# EAGLE design VOC&eCO2_Gas_Sensor (EAGLE 6.4)

## Sheet 1 of 2
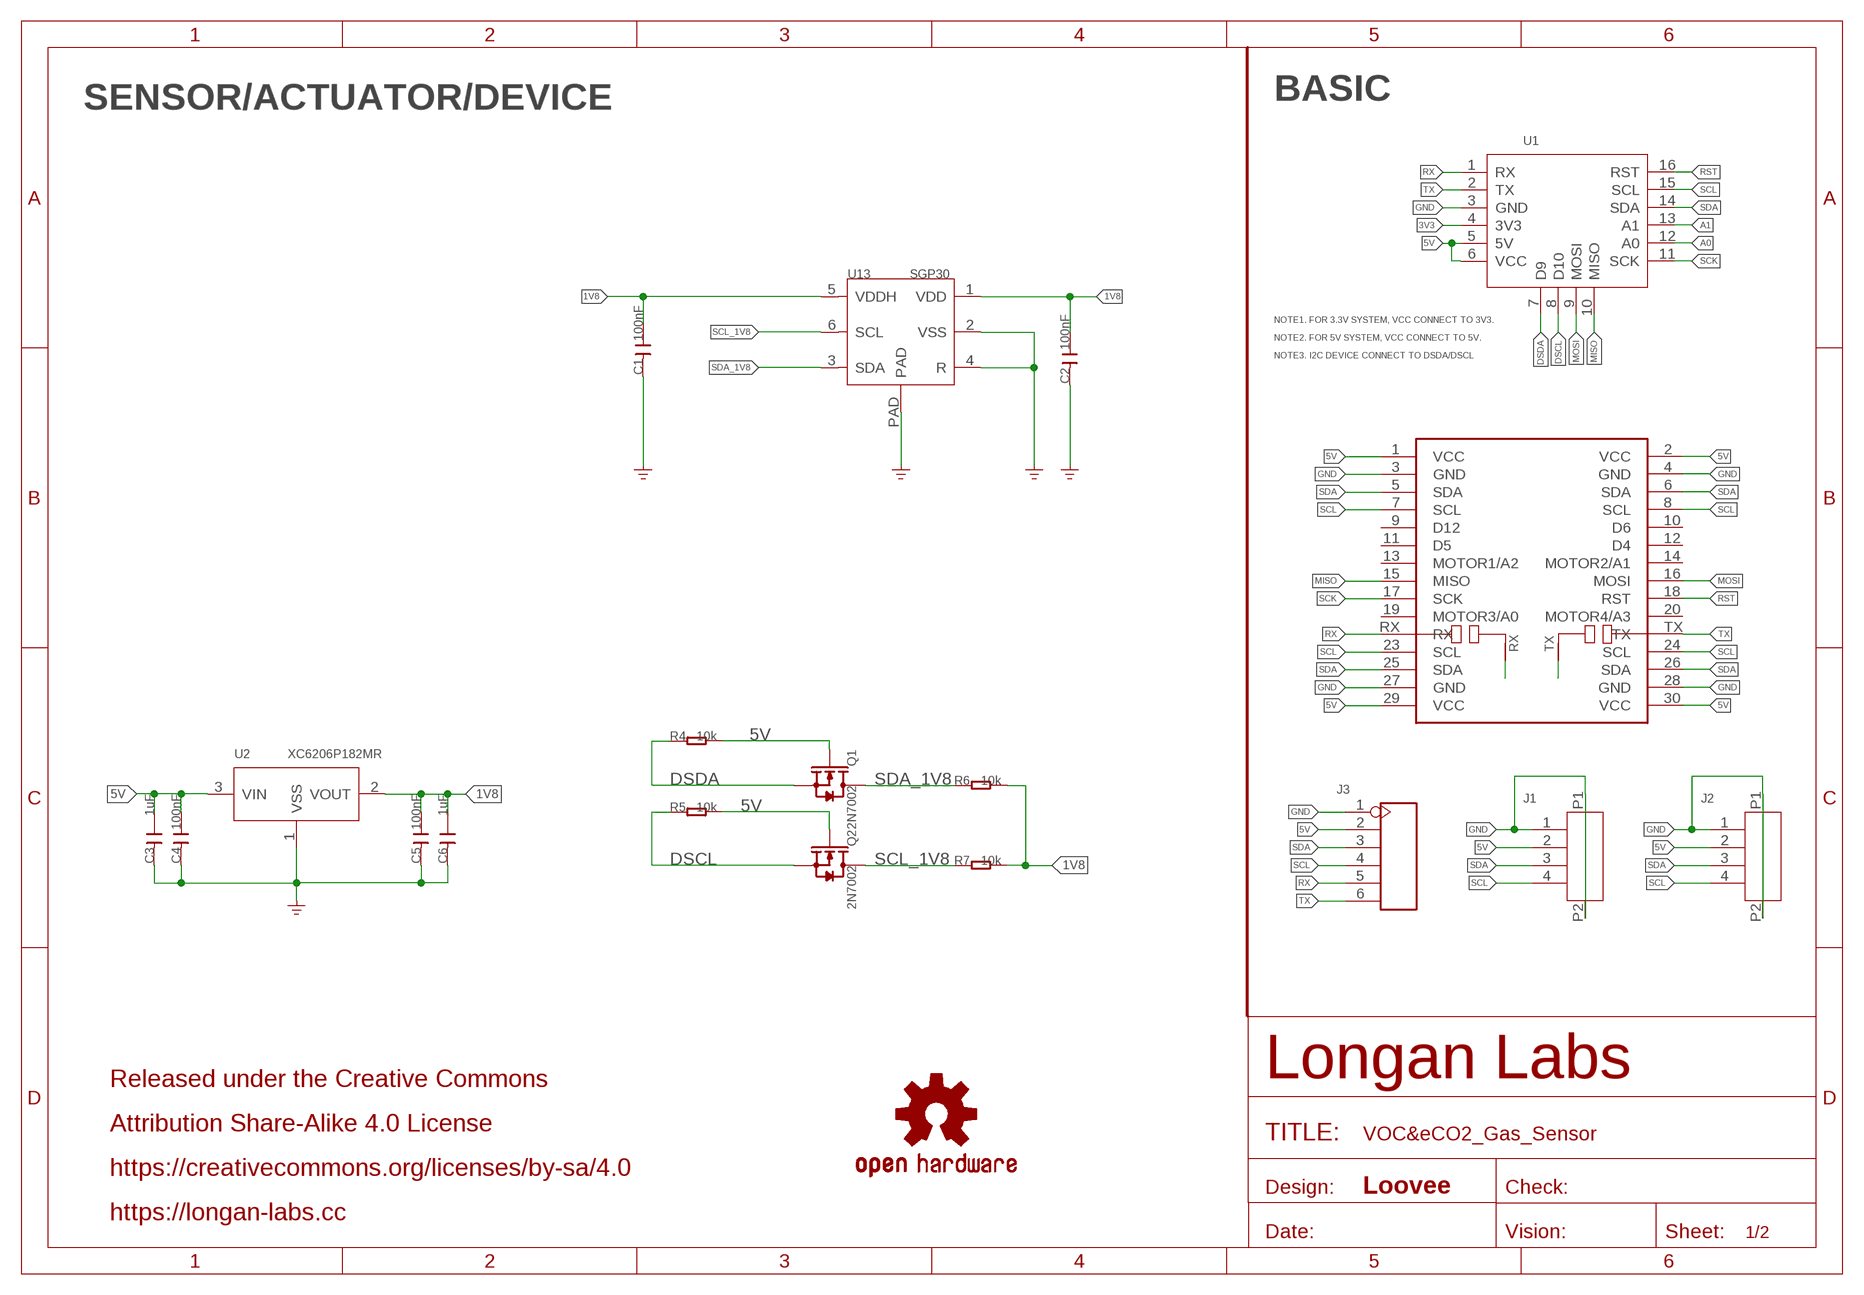
[diagram p0: schematic, sheet 1]

### Parts
C1  100nF  CAP-0603  [C0603]
C2  100nF  CAP-0603  [C0603]
C3  1uF  CAP-0603  [C0603]
C4  100nF  CAP-0603  [C0603]
C5  100nF  CAP-0603  [C0603]
C6  1uF  CAP-0603  [C0603]
J1  HEADER-4P-1.0  [4P-1.0-90D]
J2  HEADER-4P-1.0  [4P-1.0-90D]
J3  HEADER-6P-55/35MIL  [H6-2.54]
LOGO2  OSHW-LOGOS  [OSHW-LOGO-S]
MOUDLE2  MOUDLE-CARDS-UART'BOARD'  [MOUDLE-2X15P-UART]
Q1  2N7002  MOSFET-N'SOT23'  [SOT23]
Q2  2N7002  MOSFET-N'SOT23'  [SOT23]
R4  10k  R-0603  [R0603]
R5  10k  R-0603  [R0603]
R6  10k  R-0603  [R0603]
R7  10k  R-0603  [R0603]
U1  MOUDLE-CARDS  [16P-2.0-CARDS]
U2  XC6206P182MR  PMIC-XC6206PMR  [SOT-23]
U13  SGP30  SENSOR-GAS-SGP30  [DFN6-0.8-2.45X2.45X0.9MM]

### Nets
1V8: C1.1 C2.1 C5.1 C6.1 R6.2 R7.2 U2.2(VOUT) U13.1(VDD) U13.5(VDDH)
3V3: U1.4(3V3)
5V: C3.1 C4.1 J1.2 J2.2 J3.2 MOUDLE2.1(VCC) MOUDLE2.2(VCC) MOUDLE2.29(VCC) MOUDLE2.30(VCC) Q1.1(G) Q2.1(G) R4.2 R5.2 U1.5(5V) U1.6(VCC) U2.3(VIN)
A0: U1.12(A0)
A1: U1.13(A1)
DSCL: Q2.2(S) R5.1 U1.8(D10)
DSDA: Q1.2(S) R4.1 U1.7(D9)
GND: C1.2 C2.2 C3.2 C4.2 C5.2 C6.2 J1.1 J1.P1 J1.P2 J2.1 J2.P1 J2.P2 J3.1 MOUDLE2.3(GND) MOUDLE2.4(GND) MOUDLE2.27(GND) MOUDLE2.28(GND) U1.3(GND) U2.1(VSS) U13.2(VSS) U13.4(R) U13.PAD ; supply symbol labelled GND_POWER
MISO: MOUDLE2.15(MISO) U1.10(MISO)
MOSI: MOUDLE2.16(MOSI) U1.9(MOSI)
N$1: MOUDLE2.RX/N1(RX/N) MOUDLE2.RX/N2(RX/N)
N$2: MOUDLE2.TX/N1(TX/N) MOUDLE2.TX/N2(TX/N)
RST: MOUDLE2.18(RST) U1.16(RST)
RX: J3.5 MOUDLE2.RX U1.1(RX)
SCK: MOUDLE2.17(SCK) U1.11(SCK)
SCL: J1.4 J2.4 J3.4 MOUDLE2.7(SCL) MOUDLE2.8(SCL) MOUDLE2.23(SCL) MOUDLE2.24(SCL) U1.15(SCL)
SCL_1V8: Q2.3(D) R7.1 U13.6(SCL)
SDA: J1.3 J2.3 J3.3 MOUDLE2.5(SDA) MOUDLE2.6(SDA) MOUDLE2.25(SDA) MOUDLE2.26(SDA) U1.14(SDA)
SDA_1V8: Q1.3(D) R6.1 U13.3(SDA)
TX: J3.6 MOUDLE2.TX U1.2(TX)
Unconnected: MOUDLE2.9(D12) MOUDLE2.10(D6) MOUDLE2.11(D5) MOUDLE2.12(D4) MOUDLE2.13(MOTOR1/A2) MOUDLE2.14(MOTOR2/A1) MOUDLE2.19(MOTOR3/A0) MOUDLE2.20(MOTOR4/A3)

### Notes on the sheet
- SENSOR/ACTUATOR/DEVICE | BASIC
- NOTE1. FOR 3.3V SYSTEM, VCC CONNECT TO 3V3.
- NOTE2. FOR 5V SYSTEM, VCC CONNECT TO 5V.
- NOTE3. I2C DEVICE CONNECT TO DSDA/DSCL
- Released under the Creative Commons
- Attribution Share-Alike 4.0 License
- https://creativecommons.org/licenses/by-sa/4.0
- Loovee
- https://longan-labs.cc

## Sheet 2 of 2

## Library data of the parts
C1-C6 = Discrete-new:CAP: Ceramic Capacitors
J1 J2 = Longan-Connect:HEADER-4P-1.0
J3 = Connector-new:HEADER-6P
LOGO2 = SparkFun-Aesthetics:OSHW-LOGO: Open-Source Hardware (OSHW) Logo This logo indicates the piece of hardware it is found on incorporates a OSHW license and/or adheres to the definition of open source hardware found here: http://freedomdefined.org/OSHW
MOUDLE2 = Longan-moudle:MOUDLE-CARDS-UART
Q1 Q2 = Discrete:MOSFET-N: IRLL014: http://www.vishay.com/docs/91319/sihll014.pdf
R4-R7 = Discrete:R*
U1 = MOUDLE-CARDS:MOUDLE-CARDS
U2 = IC-new:PMIC-XC6206P: LOW ESR Cap.Compatible Positive Voltage Regulators
U13 = Discrete-new:SENSOR-GAS-SGP30

## Net classes
0 default: width 0.203 mm, drill 0.254 mm, clearance 0.152 mm

## Board
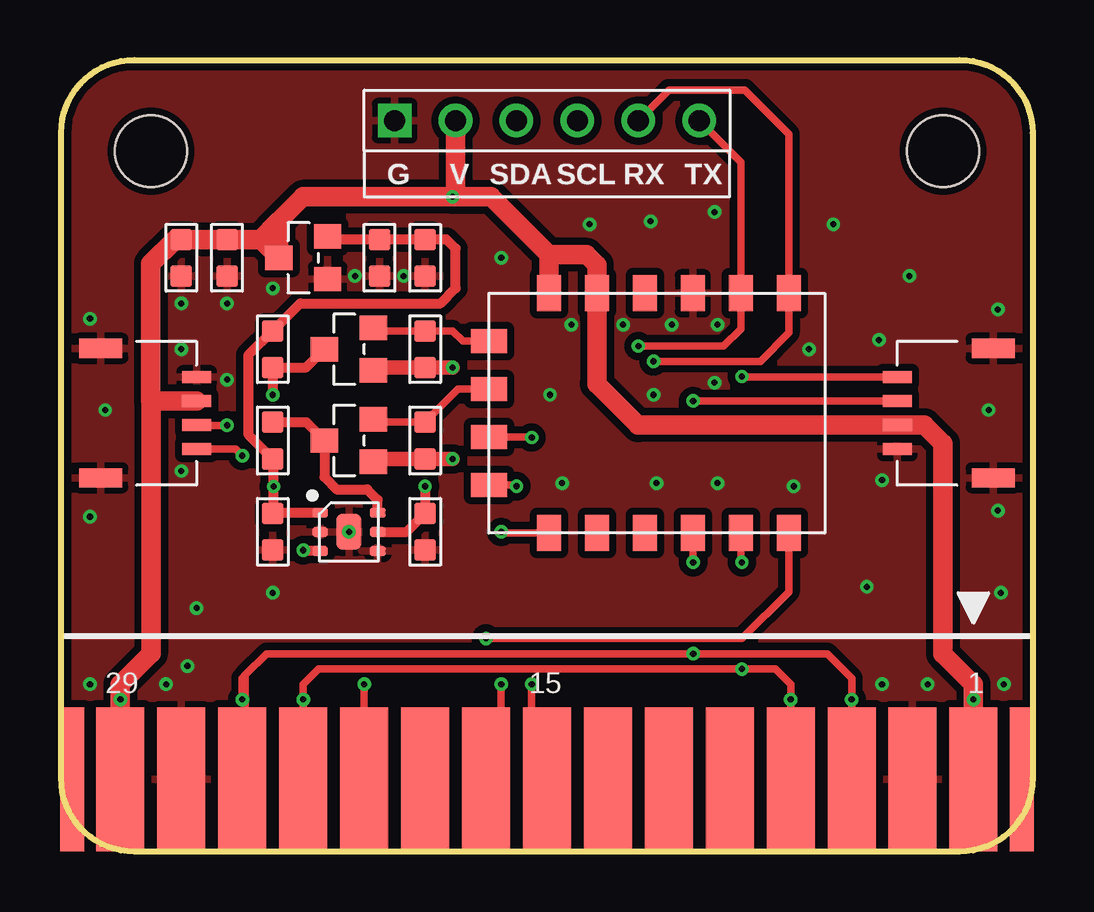
[diagram p1: board, top side]
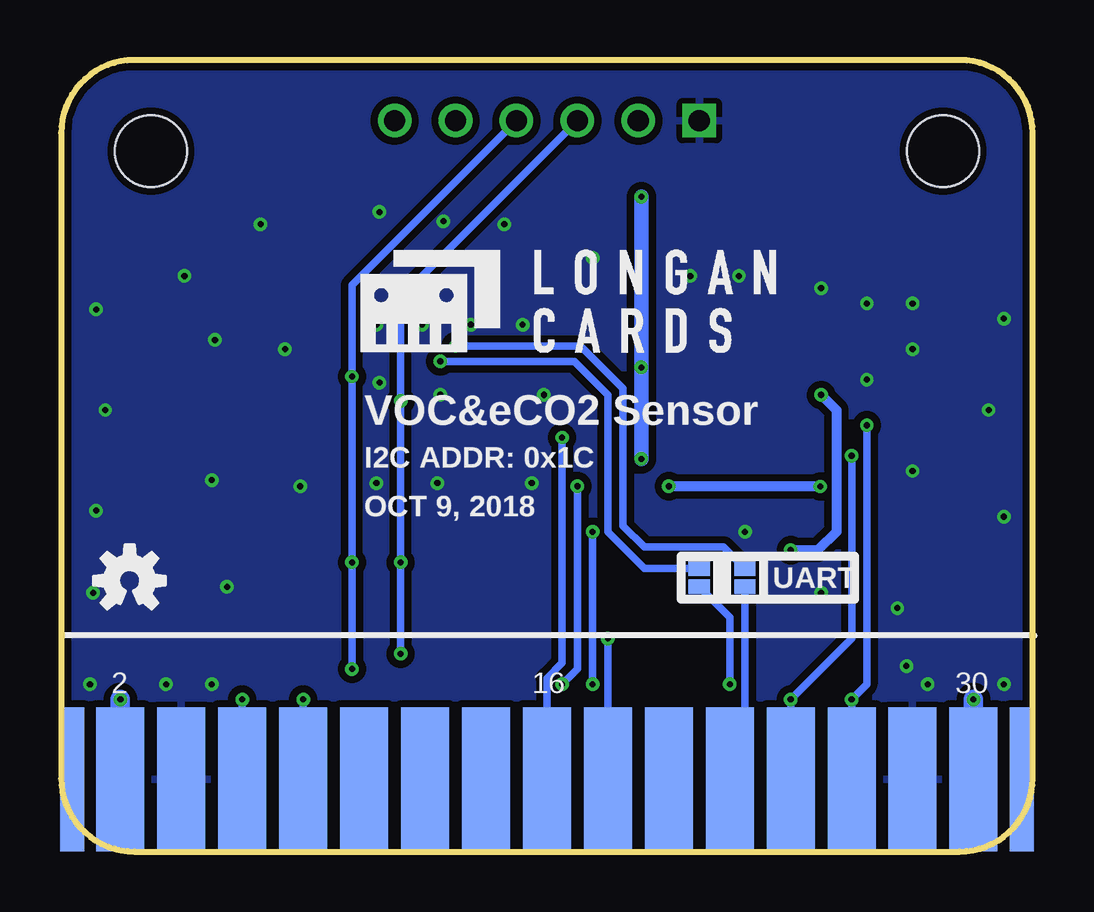
[diagram p2: board, bottom side, seen from below]

Size 40.5 x 33 mm. Coordinates in mm from the lower left corner, seen from the top.
Copper layers (1*16): Top 0.035mm / dielectric 1.5mm / Bottom 0.035mm
Design rules "SeeedStudio_2layer_DRU_no_angle_20140221 *": minimum track width 6mil, minimum drill 10mil, track to track 6mil, track to pad 6mil, pad to pad 6mil, via to via 6mil, smd to smd 0mil, copper to edge 10mil, drill to drill 10mil, minimum pad ring 10mil, minimum via ring 6mil, stop-mask expansion 2mil, vias tented up to drill 25mil, thermal gap 10mil

### Footprints (pad centres in the part's own frame; a part is rotated, then mirrored left to right if it is on the bottom)
C0603 = smd 0.889 x 0.889: 1 0,0.762; 2 0,-0.762
4P-1.0-90D = smd 1.2 x 0.5: 1 0,1.5; 2 0,0.5; 3 0,-0.5; 4 0,-1.5 | smd 1.8 x 0.8: P1 -4,2.7; P2 -4,-2.7
H6-2.54 = drill 0.889 pad 1.397 square: 1 0,6.35 | drill 0.889 pad 1.397: 2 0,3.81; 3 0,1.27; 4 0,-1.27; 5 0,-3.81; 6 0,-6.35
MOUDLE-2X15P-UART = smd 2 x 6: 1 17.78,-13.492; 3 15.24,-13.492; 5 12.7,-13.492; 7 10.16,-13.492; 9 7.62,-13.492; 11 5.08,-13.492; 13 2.54,-13.492; 15 0,-13.492; 17 -2.54,-13.492; 19 -5.08,-13.492; 23 -10.16,-13.492; 25 -12.7,-13.492; 27 -15.24,-13.492; 29 -17.78,-13.492; RX/N2 -7.62,-13.492 | smd 2 x 6 bottom: 2 17.78,-13.492; 4 15.24,-13.492; 6 12.7,-13.492; 8 10.16,-13.492; 10 7.62,-13.492; 12 5.08,-13.492; 14 2.54,-13.492; 16 0,-13.492; 18 -2.54,-13.492; 20 -5.08,-13.492; 24 -10.16,-13.492; 26 -12.7,-13.492; 28 -15.24,-13.492; 30 -17.78,-13.492; TX/N2 -7.62,-13.492 | smd 1 x 6: P1 -19.8,-13.492; P4 19.8,-13.492 | smd 1 x 6 bottom: P2 -19.8,-13.492; P3 19.8,-13.492 | smd 0.889 x 0.61 bottom: RX -6.35,-4.699; RX/N1 -6.35,-5.461; TX -8.255,-4.699; TX/N1 -8.255,-5.461 | hole 3: -16.51,12.7; 16.51,12.7
SOT23 = smd 1.016 x 1.143: 1 -0.889,-1.016; 2 0.889,-1.016; 3 0,1.016
R0603 = smd 0.889 x 0.889: 1 -0.762,0; 2 0.762,0
16P-2.0-CARDS = smd 1.5 x 1: 1 -5,5; 2 -5,3; 3 -5,1; 4 -5,-1; 5 -5,-3; 6 -5,-5; 11 5,-5; 12 5,-3; 13 5,-1; 14 5,1; 15 5,3; 16 5,5 | smd 1 x 1.5: 7 -3,-7.5; 8 -1,-7.5; 9 1,-7.5; 10 3,-7.5
SOT-23 = smd 1.016 x 1.143: 1 -0.889,-1.016; 2 0.889,-1.016; 3 0,1.016
DFN6-0.8-2.45X2.45X0.9MM = smd 0.65 x 0.4: 1 -1.2,0.8; 2 -1.2,0; 3 -1.2,-0.8; 4 1.2,-0.8; 5 1.2,0; 6 1.2,0.8 | smd 1.05 x 1.5: PAD 0,0

### Placement (x,y rotation side)
C1  15.17,13.32 0 top
C2  8.82,13.32 0 top
C3  5.01,24.76 0 top
C4  6.91,24.76 0 top
C5  15.17,24.76 0 top
C6  13.27,24.76 0 top
J1  5.64,18.28 0 top
J2  34.86,18.28 180 top
J3  20.25,30.47 90 top
LOGO2  37.65,11.29 0 bottom
MOUDLE2  20.25,16.5 0 top
Q1  11.99,20.95 90 top
Q2  11.99,17.14 90 top
R4  15.17,20.95 270 top
R5  15.17,17.14 270 top
R6  8.82,20.95 90 top
R7  8.82,17.14 270 top
U1  25.33,18.28 270 top
U2  10.09,24.76 90 top
U13  11.99,13.32 0 top
U$1  [LONGAN-CARDS-MIDDLE]  28.76,20.31 0 bottom

### Tracks (layer width: path | path; a pad name or v marks a point on that pad's centre or on a via)
1V8  (via drill 0.25 pad 0.51)
  Top 0.406: U13.1 8.86,14.12 | 8.86,14.12 C2.1 | U13.5 14.41,13.32 C1.1 v15.17,15.23 | 8.86,14.12 v8.86,15.22 8.86,16.34 R7.2 7.8,17.39 7.8,20.69 R6.2 9.96,22.85 15.8,22.85 16.44,23.48 16.44,25.14 16.06,25.52 C5.1 C6.1 11.23,25.52 U2.2
  Bottom 0.406: v8.86,15.22 v15.16,15.22 v15.17,15.23
5V  (via drill 0.25 pad 0.51)
  Top 0.508: U1.5 22.33,22.24 | 38.03,6.47 v38.03,6.34
  Top 0.61: Q1.1 13.14,20.18 R4.2 v16.31,20.18 | Q2.1 13.14,16.37 R5.2 v16.31,16.37 | v16.31,27.3 16.95,27.3
  Top 0.813: 3.75,18.78 3.75,8.25 2.47,6.97 v2.47,6.34 MOUDLE2.30 | 38.03,6.47 38.03,6.97 36.76,8.24 36.76,17.01 35.99,17.78 J2.2 24.05,17.78 22.33,19.5 22.33,22.24 22.33,24.45 21.9,24.88 20.33,24.88 | 3.75,18.78 J1.2 | 3.75,18.78 3.74,18.79 3.74,24.5 4.76,25.52 C3.1 C4.1 8.31,25.52 | U1.6 20.33,24.88 | 8.31,25.52 U2.3 9.07,26.28 | J3.2 16.44,27.3 | 16.44,27.3 v16.31,27.3 10.09,27.3 9.07,26.28 | 8.31,25.52 9.07,26.28 | 16.44,27.3 16.95,27.3 17.92,27.3 20.33,24.88 | v38.03,6.34 MOUDLE2.2
  Bottom 0.61: v16.31,16.37 v16.31,20.18 v16.31,27.3
  Bottom 0.813: v2.47,6.34 MOUDLE2.30 | v38.03,6.34 MOUDLE2.2
DSCL
  Top 0.305: U1.8 16.55,19.28 R5.1 13.14,17.9 Q2.2
DSDA
  Top 0.305: Q1.2 13.14,21.71 R4.1 16.31,21.71 16.74,21.28 U1.7
GND  (via drill 0.25 pad 0.51)
  other vias: 34.22,6.97 36.12,6.97 39.3,6.97 4.38,6.97 5.26,7.74 1.2,6.97 1.84,18.41 5.01,15.87 1.2,13.96 1.2,22.21 5.01,20.95 18.34,24.76 21.27,21.96 25.46,21.96 27.36,21.96 23.43,21.96 24.7,19.04 27.23,19.55 20.38,19.04 20.89,15.36 24.82,15.36 27.36,15.36 30.54,15.23 38.66,18.41 39.05,22.6 39.05,14.21 34.22,15.48 34.09,21.33 27.23,26.66 24.57,26.28 22.03,26.15 31.17,20.95 32.19,26.15 35.36,23.99 33.59,11.04 39.17,10.79 11.99,13.32 8.82,10.79 14.28,23.99 12.25,23.99 8.82,23.48 6.91,22.85 5.01,22.85 6.91,19.68 5.64,10.15
  pour Top (isolate 0.305): -0.07,33.01 40.57,33.01 40.57,-0.01 -0.07,-0.01
  pour Bottom (isolate 0.305): -0.07,33.01 40.57,33.01 40.57,-0.01 -0.07,-0.01
MISO  (via drill 0.25 pad 0.51)
  Top 0.305: U1.10 18.93,15.28 v18.98,15.23 | v19.61,6.97 19.61,3.64 MOUDLE2.15
  Bottom 0.305: v18.98,15.23 18.98,7.61 v19.61,6.97
MOSI  (via drill 0.25 pad 0.51)
  Top 0.305: U1.9 19.6,17.28 v19.61,17.26
  Bottom 0.305: v19.61,17.26 19.61,7.86 20.25,7.23 MOUDLE2.16
N$1  (via drill 0.25 pad 0.51)
  Top 0.305: MOUDLE2.RX/N2 v12.63,6.97
  Bottom 0.305: v12.63,6.97 12.63,9.77 MOUDLE2.RX/N1
N$2
  Bottom 0.305: MOUDLE2.TX/N1 11.99,3.64 MOUDLE2.TX/N2
RST  (via drill 0.25 pad 0.51)
  Top 0.305: U1.16 30.33,10.83 28.38,8.88 v17.71,8.88
  Bottom 0.305: v17.71,8.88 MOUDLE2.18
RX  (via drill 0.25 pad 0.51)
  Top 0.305: J3.5 25.33,31.74 28.51,31.74 30.33,29.91 U1.1 30.33,21.63 29.14,20.44 v24.7,20.44
  Bottom 0.305: v24.7,20.44 19.11,20.44 17.71,19.04 17.71,13.32 16.19,11.8 MOUDLE2.RX
SCK  (via drill 0.25 pad 0.51)
  Top 0.305: U1.11 18.39,13.28 v18.34,13.32 | v18.34,6.97 18.34,3.64 MOUDLE2.17
  Bottom 0.305: v18.34,13.32 v18.34,6.97
SCL  (via drill 0.25 pad 0.51)
  Top 0.305: U1.15 28.33,12.1 v28.38,12.05 | J2.4 28.4,19.78 v28.38,19.8 | J1.4 7.27,16.78 v7.55,16.5 | MOUDLE2.23 v10.09,6.34 10.09,6.97 10.72,7.61 v28.38,7.61 29.77,7.61 30.41,6.97 v30.41,6.34 MOUDLE2.8
  Bottom 0.305: J3.4 28.38,23.61 v28.38,19.8 v28.38,12.05 v28.38,7.61 | v7.55,16.5 7.55,8.88 v10.09,6.34 MOUDLE2.23 | v30.41,6.34 MOUDLE2.8
SCL_1V8
  Top 0.406: R7.1 10.22,17.9 Q2.3 10.98,15.61 11.49,15.1 12.76,15.1 13.2,14.66 U13.6
SDA  (via drill 0.25 pad 0.51)
  Top 0.305: 7.68,7.36 8.57,8.24 v26.35,8.24 31.93,8.24 32.95,7.23 32.95,6.97 v32.95,6.34 MOUDLE2.6 | 7.68,7.36 7.55,7.23 v7.55,6.34 | U1.14 26.33,12.07 v26.35,12.05 | J2.3 26.35,18.78 v26.35,18.79 | v6.91,17.77 5.65,17.77 J1.3 | 7.68,7.36 7.68,3.13 MOUDLE2.25
  Bottom 0.305: J3.3 26.35,23.1 v26.35,18.79 v26.35,12.05 v26.35,8.24 | v6.91,17.77 6.91,6.97 v7.55,6.34 MOUDLE2.25 | v32.95,6.34 MOUDLE2.6
SDA_1V8  (via drill 0.25 pad 0.51)
  Top 0.406: Q1.3 10.22,20.18 R6.1 v8.82,19.04 | U13.3 10.13,12.53 v10.09,12.56
  Bottom 0.406: v8.82,19.04 8.19,18.41 8.19,13.32 8.95,12.56 v10.09,12.56
TX  (via drill 0.25 pad 0.51)
  Top 0.305: J3.6 28.33,28.74 U1.2 28.33,21.79 27.62,21.07 v24.06,21.07
  Bottom 0.305: v24.06,21.07 18.85,21.07 17.07,19.29 17.07,13.58 16.19,12.69 12.88,12.69 MOUDLE2.TX

### Text on the board
tPlace: G | V | SDA | SCL | RX | TX
bPlace: VOC&eCO2 Sensor | I2C ADDR: 0x1C | OCT 9, 2018